# EAGLE design Trial (EAGLE 9.6.2)
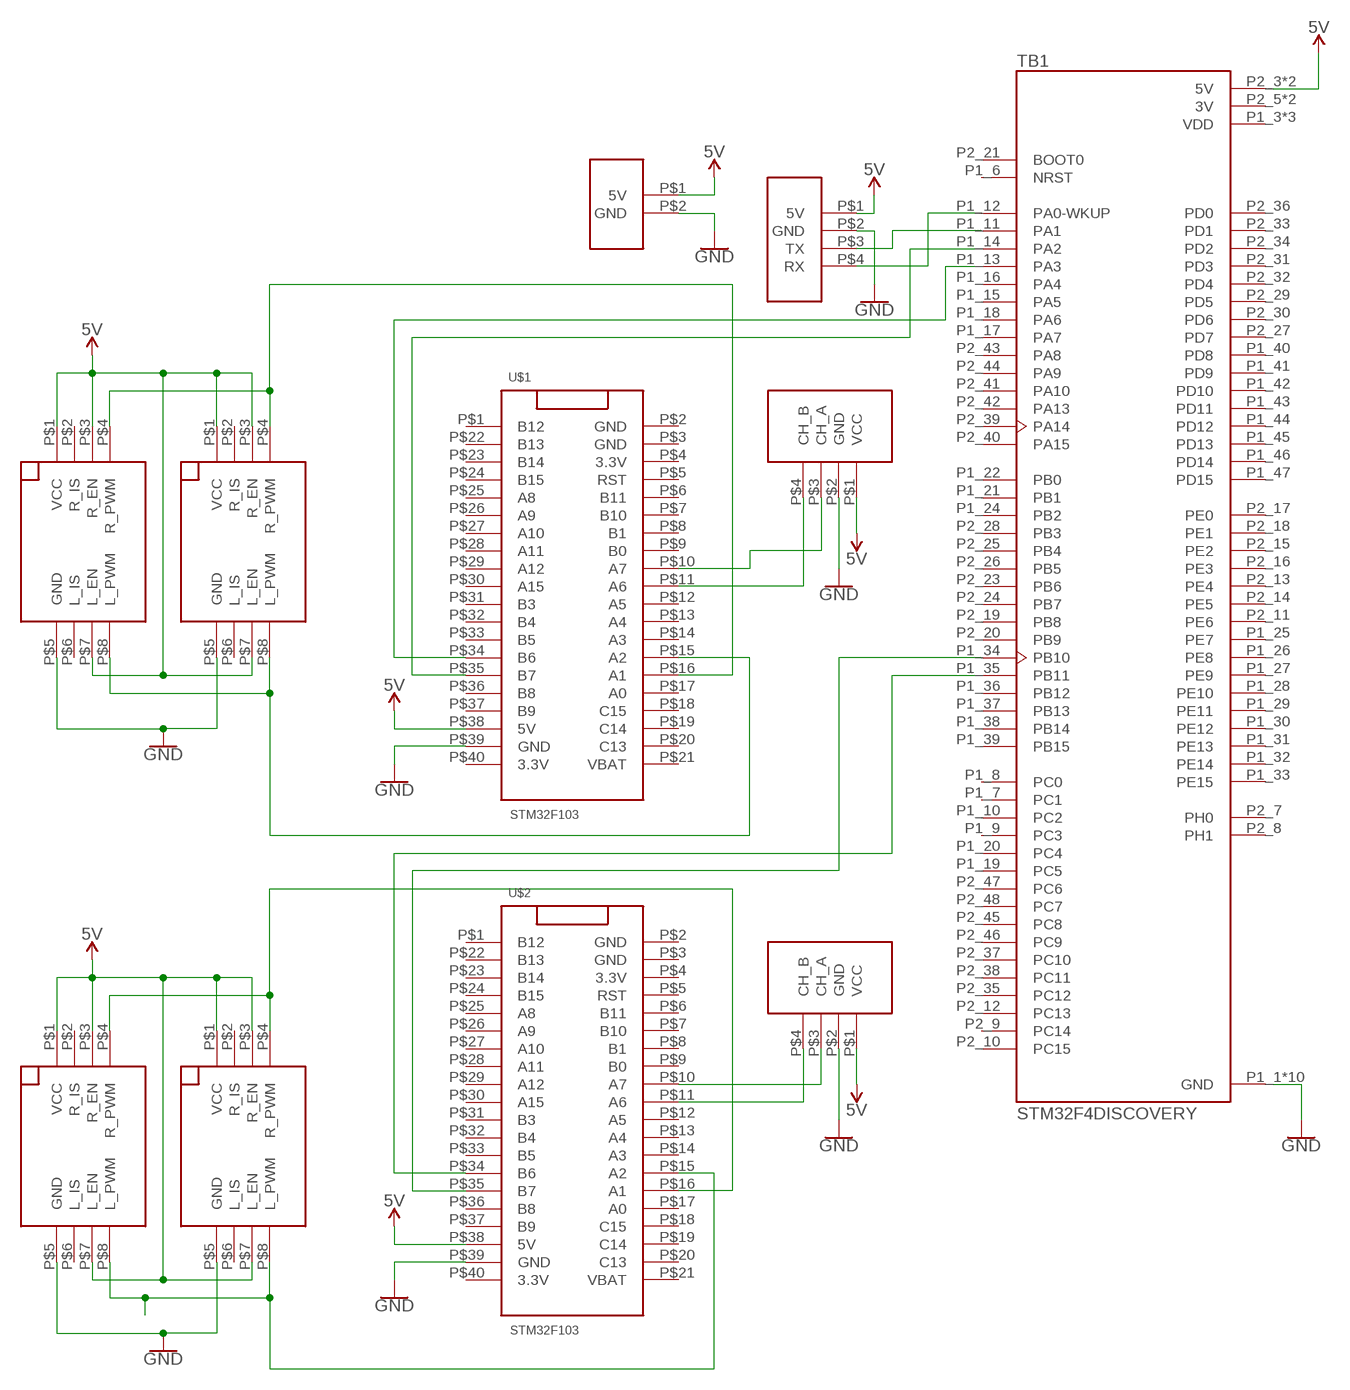
[diagram p0: schematic, sheet 1]

## Parts
TB1  STM32F4DISCOVERY  [MODULE_STM32F4DISCOVERY]
U$1  STM32F103  [BLUEPILL]
U$2  STM32F103  [BLUEPILL]
U$3  MD_HEADER  [MD_HEADER]
U$4  MD_HEADER  [MD_HEADER]
U$5  MD_HEADER  [MD_HEADER]
U$6  MD_HEADER  [MD_HEADER]
U$7  TTL_HEADER  [TTL_HEADER]
U$9  ENCODER_HEADER  [ENCODER_HEADER]
U$11  5V_HEADER  [5V_HEADER]
U$12  ENCODER_HEADER  [ENCODER_HEADER]

## Nets
5V: TB1.P2_3(5V) TB1.P2_4(5V) U$1.P$38(5V) U$2.P$38(5V) U$3.P$1(VCC) U$3.P$3(R_EN) U$3.P$7(L_EN) U$4.P$1(VCC) U$4.P$3(R_EN) U$4.P$7(L_EN) U$5.P$1(VCC) U$5.P$3(R_EN) U$5.P$7(L_EN) U$6.P$1(VCC) U$6.P$3(R_EN) U$6.P$7(L_EN) U$7.P$1(5V) U$9.P$1(VCC) U$11.P$1(5V) U$12.P$1(VCC)
GND: TB1.P1_1(GND) TB1.P1_2(GND) TB1.P1_5(GND) TB1.P1_23(GND) TB1.P1_49(GND) TB1.P1_50(GND) TB1.P2_1(GND) TB1.P2_2(GND) TB1.P2_49(GND) TB1.P2_50(GND) U$1.P$39(GND) U$2.P$39(GND) U$3.P$5(GND) U$4.P$5(GND) U$5.P$5(GND) U$6.P$5(GND) U$7.P$2(GND) U$9.P$2(GND) U$11.P$2(GND) U$12.P$2(GND)
N$1: TB1.P1_12(PA0-WKUP) U$7.P$4(RX)
N$2: TB1.P1_11(PA1) U$7.P$3(TX)
N$3: TB1.P1_13(PA3) U$1.P$34(B6)
N$4: TB1.P1_14(PA2) U$1.P$35(B7)
N$5: TB1.P1_35(PB11) U$2.P$34(B6)
N$6: TB1.P1_34(PB10) U$2.P$35(B7)
N$8: U$1.P$15(A2) U$5.P$8(L_PWM) U$6.P$8(L_PWM)
N$11: U$1.P$11(A6) U$9.P$4(CH_B)
N$12: U$1.P$10(A7) U$9.P$3(CH_A)
N$13: U$2.P$11(A6) U$12.P$4(CH_B)
N$14: U$2.P$10(A7) U$12.P$3(CH_A)
N$16: U$1.P$16(A1) U$5.P$4(R_PWM) U$6.P$4(R_PWM)
N$17: U$2.P$15(A2) U$3.P$8(L_PWM) U$4.P$8(L_PWM)
N$18: U$2.P$16(A1) U$3.P$4(R_PWM) U$4.P$4(R_PWM)
Unconnected: TB1.P1_6(NRST) TB1.P1_7(PC1) TB1.P1_8(PC0) TB1.P1_9(PC3) TB1.P1_10(PC2) TB1.P1_15(PA5) TB1.P1_16(PA4) TB1.P1_17(PA7) TB1.P1_18(PA6) TB1.P1_19(PC5) TB1.P1_20(PC4) TB1.P1_21(PB1) TB1.P1_22(PB0) TB1.P1_24(PB2) TB1.P1_25(PE7) TB1.P1_26(PE8) TB1.P1_27(PE9) TB1.P1_28(PE10) TB1.P1_29(PE11) TB1.P1_30(PE12) TB1.P1_31(PE13) TB1.P1_32(PE14) TB1.P1_33(PE15) TB1.P1_36(PB12) TB1.P1_37(PB13) TB1.P1_38(PB14) TB1.P1_39(PB15) TB1.P1_40(PD8) TB1.P1_41(PD9) TB1.P1_42(PD10) TB1.P1_43(PD11) TB1.P1_44(PD12) TB1.P1_45(PD13) TB1.P1_46(PD14) TB1.P1_47(PD15) TB1.P2_7(PH0) TB1.P2_8(PH1) TB1.P2_9(PC14) TB1.P2_10(PC15) TB1.P2_11(PE6) TB1.P2_12(PC13) TB1.P2_13(PE4) TB1.P2_14(PE5) TB1.P2_15(PE2) TB1.P2_16(PE3) TB1.P2_17(PE0) TB1.P2_18(PE1) TB1.P2_19(PB8) TB1.P2_20(PB9) TB1.P2_21(BOOT0) TB1.P2_23(PB6) TB1.P2_24(PB7) TB1.P2_25(PB4) TB1.P2_26(PB5) TB1.P2_27(PD7) TB1.P2_28(PB3) TB1.P2_29(PD5) TB1.P2_30(PD6) TB1.P2_31(PD3) TB1.P2_32(PD4) TB1.P2_33(PD1) TB1.P2_34(PD2) TB1.P2_35(PC12) TB1.P2_36(PD0) TB1.P2_37(PC10) TB1.P2_38(PC11) TB1.P2_39(PA14) TB1.P2_40(PA15) TB1.P2_41(PA10) TB1.P2_42(PA13) TB1.P2_43(PA8) TB1.P2_44(PA9) TB1.P2_45(PC8) TB1.P2_46(PC9) TB1.P2_47(PC6) TB1.P2_48(PC7) U$1.P$1(B12) U$1.P$2(GND) U$1.P$3(GND) U$1.P$4(3.3V) U$1.P$5(RST) U$1.P$6(B11) U$1.P$7(B10) U$1.P$8(B1) U$1.P$9(B0) U$1.P$12(A5) U$1.P$13(A4) U$1.P$14(A3) U$1.P$17(A0) U$1.P$18(C15) U$1.P$19(C14) U$1.P$20(C13) U$1.P$21(VBAT) U$1.P$22(B13) U$1.P$23(B14) U$1.P$24(B15) U$1.P$25(A8) U$1.P$26(A9) U$1.P$27(A10) U$1.P$28(A11) U$1.P$29(A12) U$1.P$30(A15) U$1.P$31(B3) U$1.P$32(B4) U$1.P$33(B5) U$1.P$36(B8) U$1.P$37(B9) U$1.P$40(3.3V) U$2.P$1(B12) U$2.P$2(GND) U$2.P$3(GND) U$2.P$4(3.3V) U$2.P$5(RST) U$2.P$6(B11) U$2.P$7(B10) U$2.P$8(B1) U$2.P$9(B0) U$2.P$12(A5) U$2.P$13(A4) U$2.P$14(A3) U$2.P$17(A0) U$2.P$18(C15) U$2.P$19(C14) U$2.P$20(C13) U$2.P$21(VBAT) U$2.P$22(B13) U$2.P$23(B14) U$2.P$24(B15) U$2.P$25(A8) U$2.P$26(A9) U$2.P$27(A10) U$2.P$28(A11) U$2.P$29(A12) U$2.P$30(A15) U$2.P$31(B3) U$2.P$32(B4) U$2.P$33(B5) U$2.P$36(B8) U$2.P$37(B9) U$2.P$40(3.3V) U$3.P$2(R_IS) U$3.P$6(L_IS) U$4.P$2(R_IS) U$4.P$6(L_IS) U$5.P$2(R_IS) U$5.P$6(L_IS) U$6.P$2(R_IS) U$6.P$6(L_IS)

## Power pins joined to a net without a drawn wire
3V: TB1.P2_5(3V) TB1.P2_6(3V)
VDD: TB1.P1_3(VDD) TB1.P1_4(VDD) TB1.P2_22(VDD)

## Library data of the parts
TB1 = Trial:STM32F4DISCOVERY: Development kit: ARM ST; pin strips, pin header; No.of Check prices <https://pricing.snapeda.com/parts/STM32F4DISCOVERY/STMicroelectronics/view-part?ref=eda>; AVAILABILITY: Bad; DESCRIPTION: STM32F407VGT6 Discovery STM32F4 ARM® Cortex®-M4 MCU 32-Bit Embedded Evaluation Board; MF: STMicroelectronics; MP: STM32F4DISCOVERY; PACKAGE: None; PRICE: None
U$1 U$2 = Trial:STM32F103
U$3-U$6 = Trial:MD_HEADER
U$7 = Trial:TTL_HEADER
U$9 U$12 = Trial:ENCODER_HEADER
U$11 = Trial:5V_HEADER

## Board
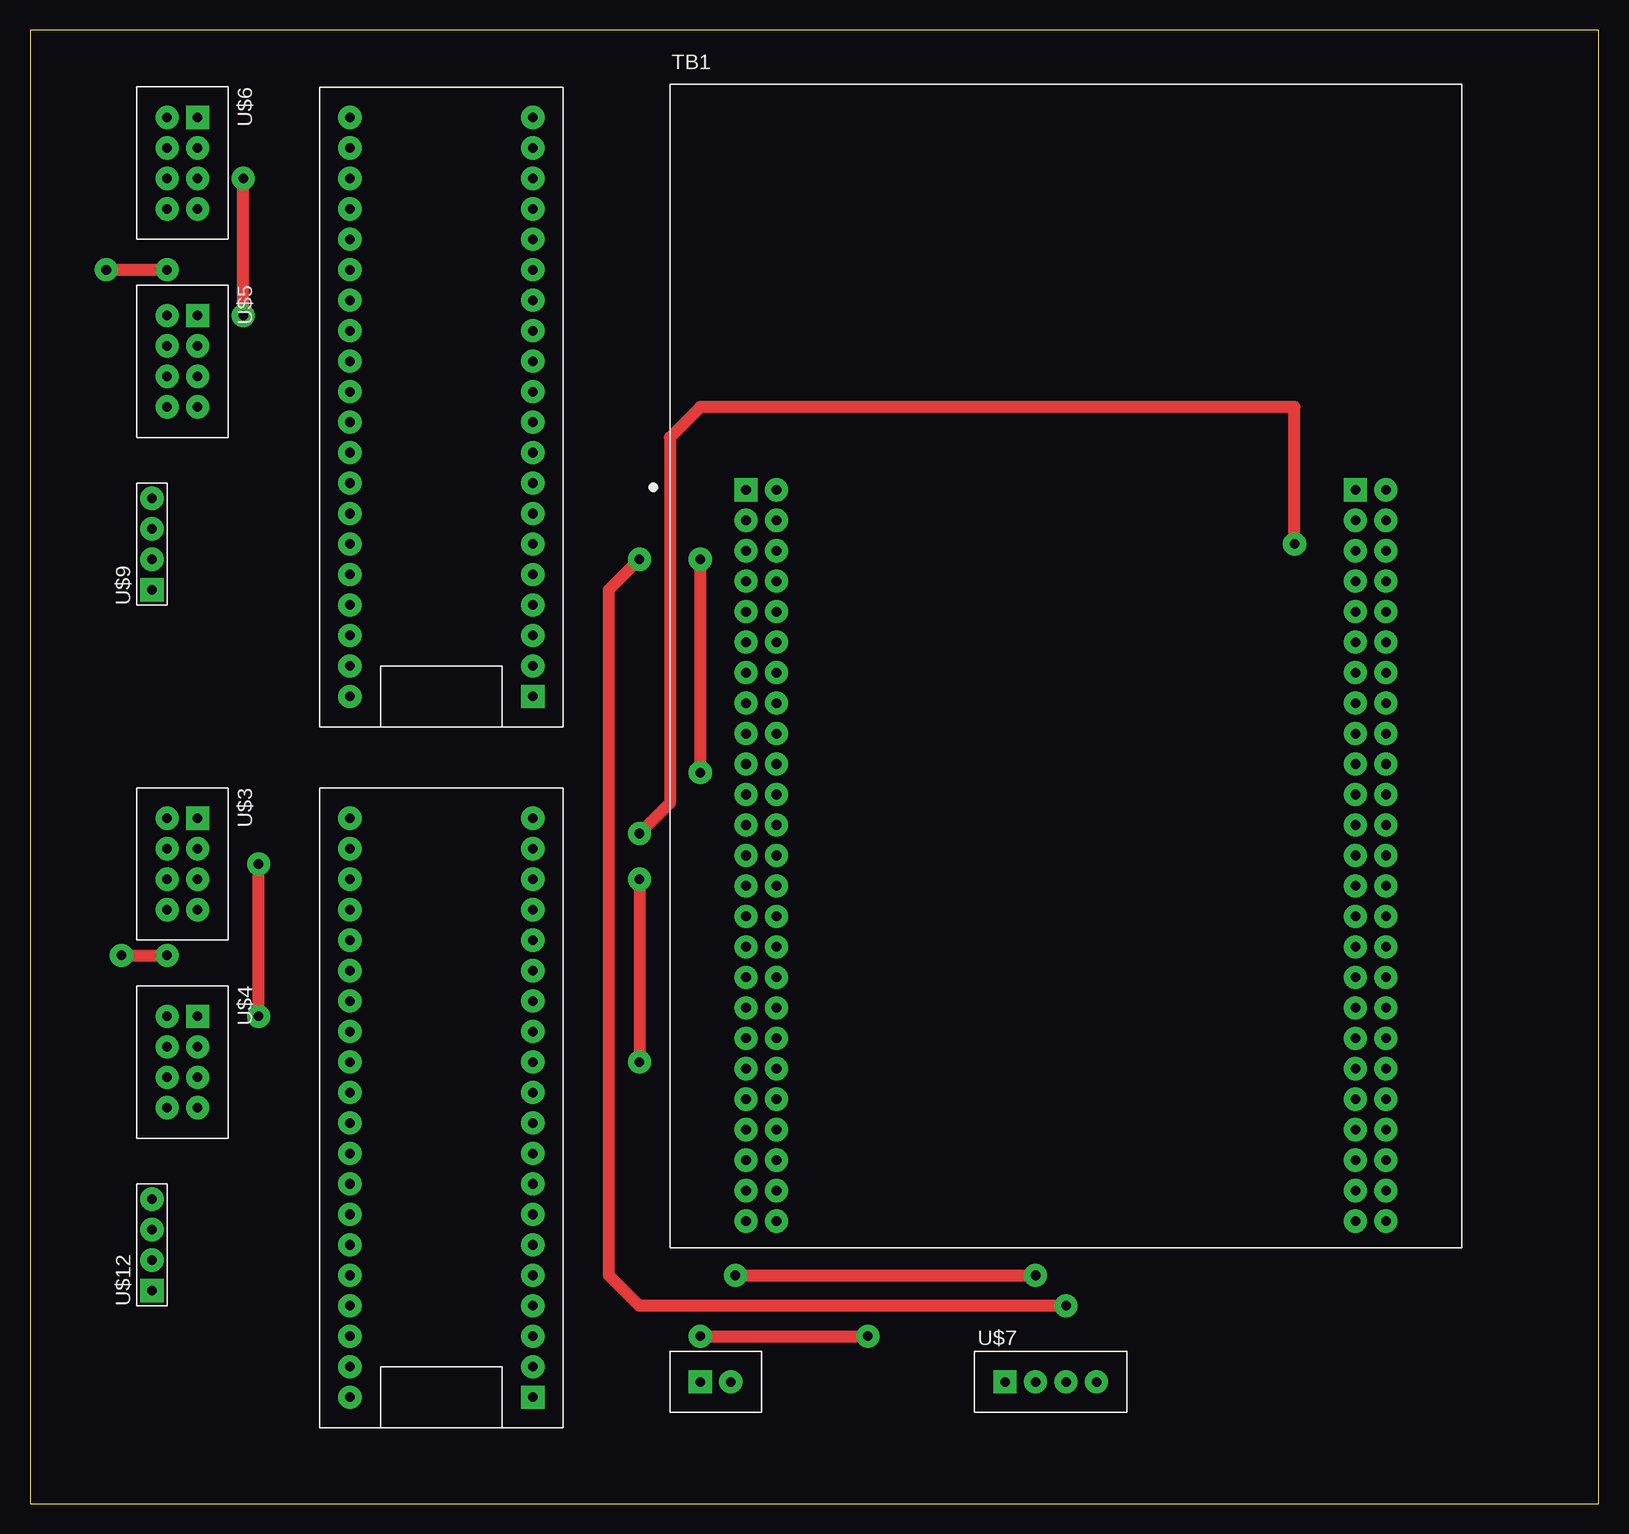
[diagram p1: board, top side]
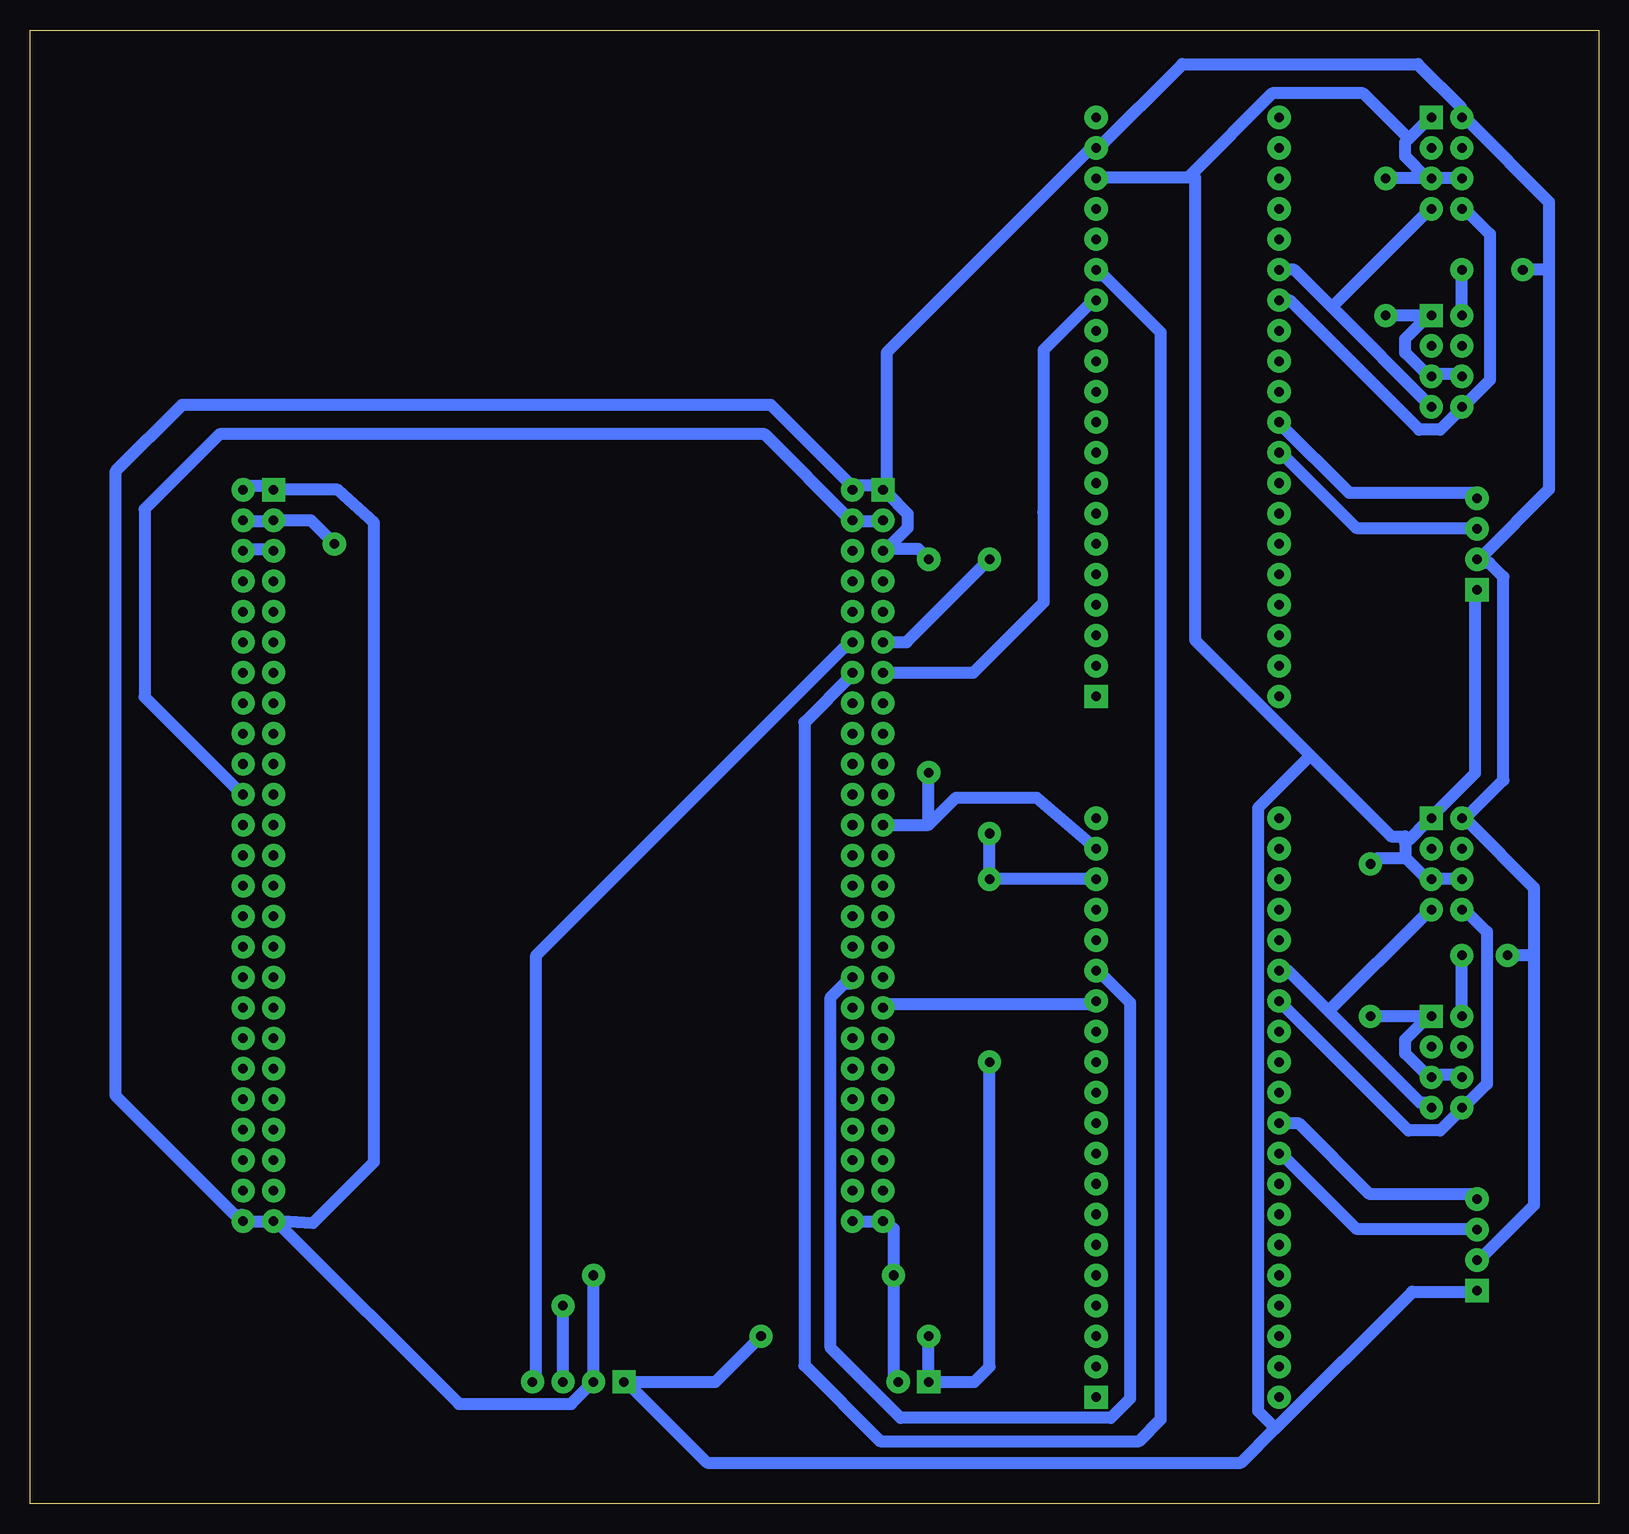
[diagram p2: board, bottom side, seen from below]

Size 130.79 x 122.86 mm. Coordinates in mm from the lower left corner, seen from the top.
Outline: 0,0 130.79,0 130.79,122.86 0,122.86 0,0
Copper layers (1*16): Top 0.035mm / dielectric 1.5mm / Bottom 0.035mm
Design rules "default *": minimum track width 40mil, minimum drill 0.35mm, track to track 6mil, track to pad 6mil, pad to pad 6mil, via to via 6mil, smd to smd 6mil, copper to edge 40mil, drill to drill 6mil, minimum pad ring 10mil, minimum via ring 8mil, stop-mask expansion 4mil, vias tented up to drill 0mil, thermal gap 10mil

### Footprints (pad centres in the part's own frame; a part is rotated, then mirrored left to right if it is on the bottom)
MODULE_STM32F4DISCOVERY = drill 0.8 pad 1.93 square: P1_1 -26.67,14.68; P2_1 24.13,14.68 | drill 0.8 pad 1.93: P1_2 -24.13,14.68; P1_3 -26.67,12.14; P1_4 -24.13,12.14; P1_5 -26.67,9.6; P1_6 -24.13,9.6; P1_7 -26.67,7.06; P1_8 -24.13,7.06; P1_9 -26.67,4.52; P1_10 -24.13,4.52; P1_11 -26.67,1.98; P1_12 -24.13,1.98; P1_13 -26.67,-0.56; P1_14 -24.13,-0.56; P1_15 -26.67,-3.1; P1_16 -24.13,-3.1; P1_17 -26.67,-5.64; P1_18 -24.13,-5.64; P1_19 -26.67,-8.18; P1_20 -24.13,-8.18; P1_21 -26.67,-10.72; P1_22 -24.13,-10.72; P1_23 -26.67,-13.26; P1_24 -24.13,-13.26; P1_25 -26.67,-15.8; P1_26 -24.13,-15.8; P1_27 -26.67,-18.34; P1_28 -24.13,-18.34; P1_29 -26.67,-20.88; P1_30 -24.13,-20.88; P1_31 -26.67,-23.42; P1_32 -24.13,-23.42; P1_33 -26.67,-25.96; P1_34 -24.13,-25.96; P1_35 -26.67,-28.5; P1_36 -24.13,-28.5; P1_37 -26.67,-31.04; P1_38 -24.13,-31.04; P1_39 -26.67,-33.58; P1_40 -24.13,-33.58; P1_41 -26.67,-36.12; P1_42 -24.13,-36.12; P1_43 -26.67,-38.66; P1_44 -24.13,-38.66; P1_45 -26.67,-41.2; P1_46 -24.13,-41.2; P1_47 -26.67,-43.74; P1_48 -24.13,-43.74; P1_49 -26.67,-46.28; P1_50 -24.13,-46.28; P2_2 26.67,14.68; P2_3 24.13,12.14; P2_4 26.67,12.14; P2_5 24.13,9.6; P2_6 26.67,9.6; P2_7 24.13,7.06; P2_8 26.67,7.06; P2_9 24.13,4.52; P2_10 26.67,4.52; P2_11 24.13,1.98; P2_12 26.67,1.98; P2_13 24.13,-0.56; P2_14 26.67,-0.56; P2_15 24.13,-3.1; P2_16 26.67,-3.1; P2_17 24.13,-5.64; P2_18 26.67,-5.64; P2_19 24.13,-8.18; P2_20 26.67,-8.18; P2_21 24.13,-10.72; P2_22 26.67,-10.72; P2_23 24.13,-13.26; P2_24 26.67,-13.26; P2_25 24.13,-15.8; P2_26 26.67,-15.8; P2_27 24.13,-18.34; P2_28 26.67,-18.34; P2_29 24.13,-20.88; P2_30 26.67,-20.88; P2_31 24.13,-23.42; P2_32 26.67,-23.42; P2_33 24.13,-25.96; P2_34 26.67,-25.96; P2_35 24.13,-28.5; P2_36 26.67,-28.5; P2_37 24.13,-31.04; P2_38 26.67,-31.04; P2_39 24.13,-33.58; P2_40 26.67,-33.58; P2_41 24.13,-36.12; P2_42 26.67,-36.12; P2_43 24.13,-38.66; P2_44 26.67,-38.66; P2_45 24.13,-41.2; P2_46 26.67,-41.2; P2_47 24.13,-43.74; P2_48 26.67,-43.74; P2_49 24.13,-46.28; P2_50 26.67,-46.28
BLUEPILL = drill 0.8 pad 1.93 square: P$1 0,0 | drill 0.8 pad 1.93: P$2 0,15.24; P$3 2.54,15.24; P$4 5.08,15.24; P$5 7.62,15.24; P$6 10.16,15.24; P$7 12.7,15.24; P$8 15.24,15.24; P$9 17.78,15.24; P$10 20.32,15.24; P$11 22.86,15.24; P$12 25.4,15.24; P$13 27.94,15.24; P$14 30.48,15.24; P$15 33.02,15.24; P$16 35.56,15.24; P$17 38.1,15.24; P$18 40.64,15.24; P$19 43.18,15.24; P$20 45.72,15.24; P$21 48.26,15.24; P$22 2.54,0; P$23 5.08,0; P$24 7.62,0; P$25 10.16,0; P$26 12.7,0; P$27 15.24,0; P$28 17.78,0; P$29 20.32,0; P$30 22.86,0; P$31 25.4,0; P$32 27.94,0; P$33 30.48,0; P$34 33.02,0; P$35 35.56,0; P$36 38.1,0; P$37 40.64,0; P$38 43.18,0; P$39 45.72,0; P$40 48.26,0
MD_HEADER = drill 0.8 pad 1.93 square: P$1 0,0 | drill 0.8 pad 1.93: P$2 2.54,0; P$3 5.08,0; P$4 7.62,0; P$5 0,-2.54; P$6 2.54,-2.54; P$7 5.08,-2.54; P$8 7.62,-2.54
TTL_HEADER = drill 0.8 pad 1.93 square: P$1 0,0 | drill 0.8 pad 1.93: P$2 2.54,0; P$3 5.08,0; P$4 7.62,0
ENCODER_HEADER = drill 0.8 pad 1.93 square: P$1 0,0 | drill 0.8 pad 1.93: P$2 2.54,0; P$3 5.08,0; P$4 7.62,0
5V_HEADER = drill 0.8 pad 1.93 square: P$1 0,0 | drill 0.8 pad 1.93: P$2 2.54,0

### Placement (x,y rotation side)
TB1  86.36,69.85 0 top
U$1  41.91,67.31 90 top
U$2  41.91,8.89 90 top
U$3  13.97,57.15 270 top
U$4  13.97,40.64 270 top
U$5  13.97,99.06 270 top
U$6  13.97,115.57 270 top
U$7  81.28,10.16 0 top
U$9  10.16,76.2 90 top
U$11  55.88,10.16 0 top
U$12  10.16,17.78 90 top

### Tracks (layer width: path | path; a pad name or v marks a point on that pad's centre or on a via)
3V
  Bottom 1.016: TB1.P2_5 110.79,79.6 112.55,79.6 TB1.P2_6
5V  (via drill 0.8 pad 1.93)
  Top 1.016: v55.88,13.97 v69.85,13.97 | v50.8,52.07 v50.8,36.83 | v19.05,40.64 v19.05,53.34 | v17.78,99.06 v17.78,110.49 | v105.41,80.01 105.41,91.44 55.88,91.44 53.34,88.9 53.34,58.42 v50.8,55.88
  Bottom 1.016: U$4.P$7 11.48,35.79 13.82,35.79 U$4.P$3 14.4,35.79 16.15,37.54 16.15,38.71 14.4,40.46 U$4.P$1 v19.05,40.64 | U$5.P$7 11.48,94.21 13.82,94.21 U$5.P$3 14.4,94.21 16.15,95.96 16.15,97.13 14.4,98.88 U$5.P$1 v17.78,99.06 | 26.96,6.29 29.82,3.43 74.35,3.43 81,10.08 U$7.P$1 73.66,10.16 v69.85,13.97 | 26.96,6.29 15.57,17.68 10.31,17.68 U$12.P$1 | U$3.P$7 11.48,52.15 13.82,52.15 U$3.P$3 14.4,52.15 16.05,53.8 | U$9.P$1 10.31,76.1 10.31,60.91 13.82,57.4 U$3.P$1 14.4,56.82 15.86,55.36 | 16.05,53.8 16.15,53.9 16.15,55.07 15.86,55.36 | U$6.P$7 11.48,110.57 13.82,110.57 U$6.P$3 | 15.86,113.78 16.15,113.49 16.15,112.32 14.4,110.57 U$6.P$3 | 15.86,113.78 14.4,115.24 U$6.P$1 | 33.97,110.86 27.25,117.58 19.66,117.58 15.86,113.78 | 33.97,110.86 34.27,110.57 41.86,110.57 U$1.P$38 | 24.04,62.37 33.68,72.01 33.68,110.57 33.97,110.86 | 24.04,62.37 17.32,55.65 16.15,55.65 15.86,55.36 | 26.96,6.29 28.42,7.75 28.42,57.99 24.04,62.37 | TB1.P2_4 112.55,81.94 110.79,81.94 TB1.P2_3 107.39,81.99 v105.41,80.01 | v55.88,13.97 U$11.P$1 52.07,10.16 50.8,11.43 v50.8,36.83 | U$2.P$38 v50.8,52.07 v50.8,55.88 | 16.05,53.8 18.59,53.8 v19.05,53.34 | U$6.P$3 v17.78,110.49
GND  (via drill 0.8 pad 1.93)
  Top 1.016: v58.8,19.05 v83.82,19.05 | v7.62,45.72 v11.43,45.72 | v6.35,102.87 v11.43,102.87 | v55.88,60.96 v55.88,78.74
  Bottom 1.016: U$11.P$2 58.8,10.67 v58.8,19.05 58.8,22.94 59.38,23.52 TB1.P1_49 59.97,23.52 61.72,23.52 TB1.P1_50 | TB1.P1_23 55.88,56.59 | 55.88,56.59 53.59,58.88 46.89,58.88 U$2.P$39 | TB1.P2_2 112.55,84.86 110.79,84.86 TB1.P2_1 105.14,84.53 102.11,81.78 102.11,28.5 107.22,23.38 TB1.P2_49 | TB1.P2_49 110.21,23.52 95.02,8.33 85.67,8.33 83.92,10.08 U$7.P$2 v83.82,19.05 | TB1.P2_49 110.79,23.52 112.55,23.52 TB1.P2_50 113.13,24.11 113.72,24.11 123.67,34.06 123.67,86.03 118.11,91.59 69.04,91.59 62.31,84.86 TB1.P1_2 61.72,84.86 59.97,84.86 TB1.P1_1 | 5.44,45.72 5.44,51.36 10.9,56.82 U$3.P$5 10.9,57.4 7.98,60.33 7.98,77.27 9.14,78.44 9.73,78.44 U$9.P$2 9.73,79.02 4.17,84.58 4.17,102.87 | 5.44,45.72 5.44,24.89 9.73,20.6 U$12.P$2 | 59.38,79.6 57.63,81.36 57.63,82.53 59.38,84.28 TB1.P1_1 | 59.38,79.6 TB1.P1_5 | TB1.P1_1 59.38,84.86 59.38,95.96 42.44,112.9 U$1.P$39 41.86,112.9 34.75,120.02 15.09,120.02 11.48,116.41 11.48,115.82 U$6.P$5 10.9,115.24 4.17,108.51 4.17,102.87 | 5.44,45.72 v7.62,45.72 | U$4.P$5 v11.43,45.72 | U$5.P$5 v11.43,102.87 | 4.17,102.87 v6.35,102.87 | 55.88,56.59 v55.88,60.96 | v55.88,78.74 56.74,79.6 59.38,79.6
N$1
  Bottom 1.016: TB1.P1_12 62.31,71.42 62.89,71.42 88.59,45.72 88.59,10.67 U$7.P$4
N$2  (via drill 0.8 pad 1.93)
  Top 1.016: v86.36,16.51 50.8,16.51 48.26,19.05 48.26,76.2 v50.8,78.74
  Bottom 1.016: TB1.P1_11 57.71,71.83 v50.8,78.74 | U$7.P$3 v86.36,16.51
N$3
  Bottom 1.016: TB1.P1_13 52.15,69.29 46.3,75.13 46.3,82.55 46.3,82.75 46.3,96.19 42.44,100.05 U$1.P$34
N$4
  Bottom 1.016: U$1.P$35 41.86,102.39 41.27,102.39 36.52,97.64 36.52,7.04 38.33,5.23 59.94,5.23 66.24,11.53 66.24,65.15 62.31,69.09 TB1.P1_14
N$5
  Bottom 1.016: TB1.P1_35 59.38,41.63 42.44,41.63 U$2.P$34
N$6
  Bottom 1.016: TB1.P1_34 62.31,43.38 62.89,43.38 64.06,42.22 64.06,13.01 58.22,7.16 40.69,7.16 39.09,8.76 39.09,41.78 41.86,44.55 U$2.P$35
N$8
  Bottom 1.016: U$6.P$8 10.9,107.65 9.09,105.84 9.09,93.68 10.9,91.87 U$5.P$8 11.48,91.29 13.23,89.54 14.99,89.54 25.78,100.33 U$1.P$15
N$11
  Bottom 1.016: U$9.P$4 10.31,84.28 20.83,84.28 26.67,90.12 U$1.P$11
N$12
  Bottom 1.016: U$9.P$3 10.31,81.36 20.24,81.36 26.67,87.78 U$1.P$10
N$13
  Bottom 1.016: U$2.P$11 25.07,31.75 19.18,25.86 10.31,25.86 U$12.P$4
N$14
  Bottom 1.016: U$12.P$3 10.31,22.94 20.24,22.94 26.67,29.36 U$2.P$10
N$16
  Bottom 1.016: 22.29,99.76 25.4,102.87 U$1.P$16 | 22.29,99.76 U$5.P$4 | 22.29,99.76 14.4,107.65 U$6.P$4
N$17
  Bottom 1.016: U$3.P$8 10.9,49.23 9.35,47.68 9.35,35 10.9,33.45 U$4.P$8 11.48,32.87 13.23,31.12 15.88,31.12 26.39,41.63 26.67,41.63 U$2.P$15
N$18
  Bottom 1.016: 22.55,41.07 25.91,44.42 25.91,44.45 U$2.P$16 | 22.55,41.07 14.94,33.45 14.4,33.45 U$4.P$4 | 22.55,41.07 14.4,49.23 U$3.P$4
VDD
  Bottom 1.016: TB1.P1_3 59.97,81.94 61.72,81.94 TB1.P1_4 62.31,81.94 69.52,89.15 114.99,89.15 121.23,82.91 121.23,67.26 113.13,59.16 TB1.P2_22